# Altium schematic sheet Sheet1.SchDoc
size A3; SheetNumber: 1; SheetTotal: 1
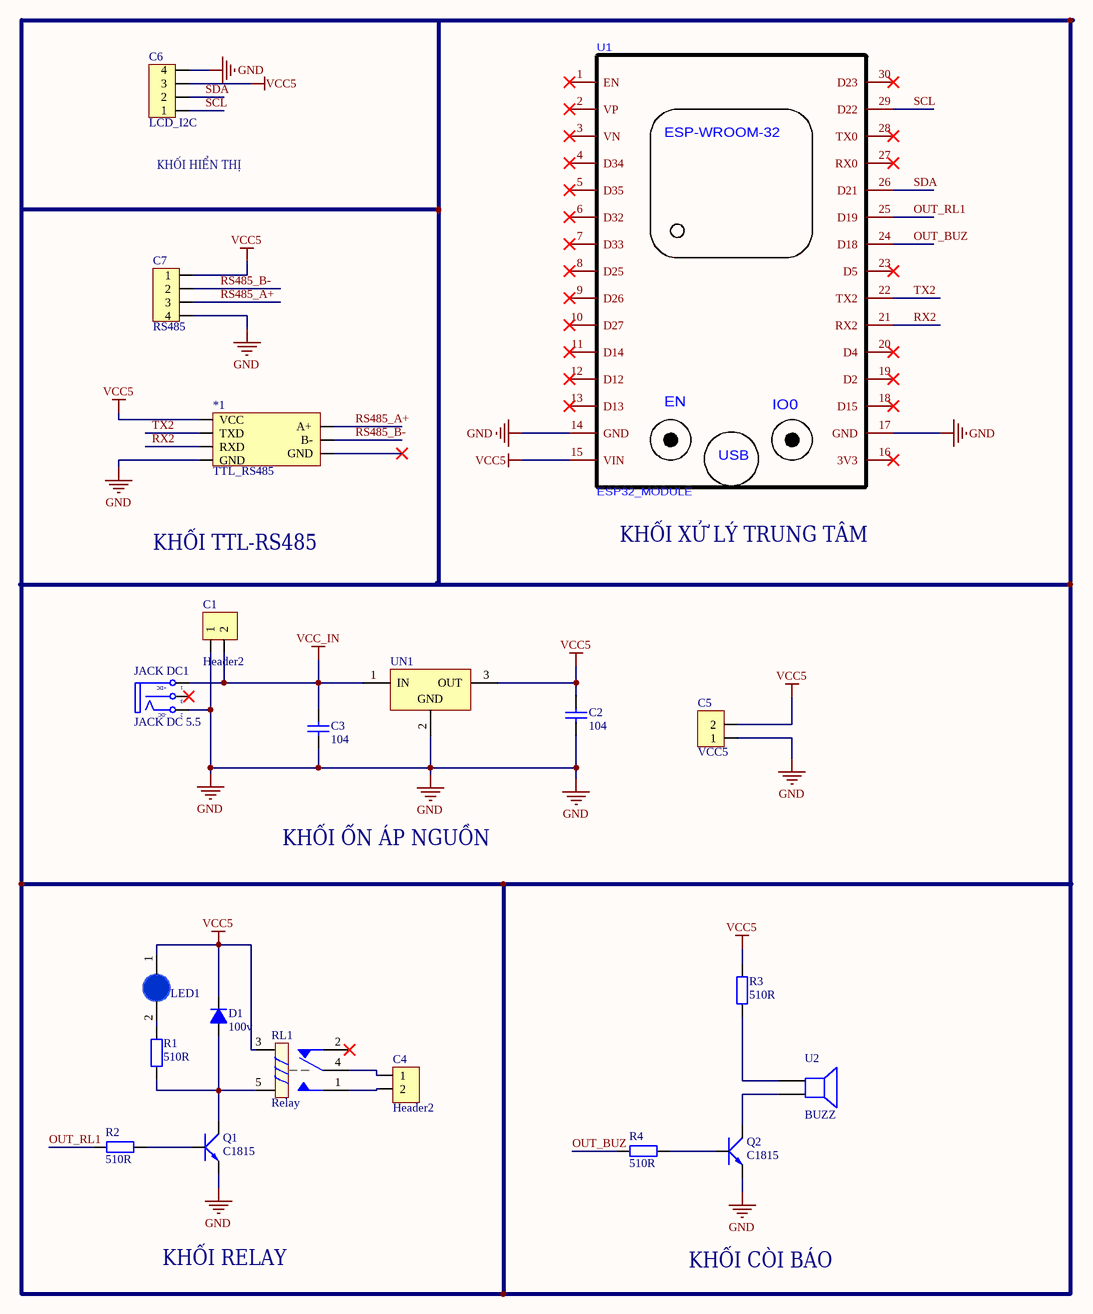
[diagram p0: Sheet1.SchDoc]

## Parts
*1  TTL_RS485  [RS-485 Module]
C1  Header2  [Header2]
C2  104  [tu gom]
C3  104  [tu gom]
C4  Header2  [Header2]
C5  VCC5  [Header2]
C6  LCD_I2C  [Header4]
C7  RS485  [Header4]
D1  100v  [DIODE 0.5A]
JACK_DC1  JACK DC 5.5  [JACK DC 5.5]
LED1  LED 3mm  [LED-3MM-BLUE]  (value not drawn)
Q1  C1815  [C1815_cam]
Q2  C1815  [C1815_cam]
R1  510R  [R1/4W]
R2  510R  [R1/4W]
R3  510R  [R1/4W]
R4  510R  [R1/4W]
RL1  Relay  [RELAY_SRA_05VDC_SL_C]
U1  ESP32_MODULE  [ESP32-WIFIMODULE-FOOTPRINT]
U2  BUZZ  [BUZZER_D9_TH]
UN1  L78M05CP  [QTO-220H2]  (value not drawn)

## Nets
GND: *1.4(GND) C1.1 C2.2 C3.2 C5.1 C6.4 C7.4 JACK_DC1.2(TN) Q1.1(E) Q2.1(E) U1.14(GND) U1.17(GND) UN1.2(GND)
VCC5: *1.1(VCC) C2.1 C5.2 C6.3 C7.1 D1.2(K) LED1.1(A) R3.1 RL1.3 U1.15(VIN) UN1.3(OUT)
VCC_IN: C1.2 C3.1 JACK_DC1.1(T) UN1.1(IN)
OUT_BUZ: R4.1 U1.24(D18)
OUT_RL1: R2.1 U1.25(D19)
RS485_A+: *1.7(A+) C7.3
RS485_B-: *1.6(B-) C7.2
RX2: *1.3(RXD) U1.21(RX2)
SCL: C6.1 U1.29(D22)
SDA: C6.2 U1.26(D21)
TX2: *1.2(TXD) U1.22(TX2)
NetC4_1: C4.1 RL1.4
NetC4_2: C4.2 RL1.1
NetD1_1: D1.1(A) Q1.2(C) R1.2 RL1.5
NetLED1_2: LED1.2(K) R1.1
NetQ1_3: Q1.3(B) R2.2
NetQ2_2: Q2.2(C) U2.2
NetQ2_3: Q2.3(B) R4.2
NetR3_2: R3.2 U2.1

Not connected (* = marked no-connect by the designer): *1 5(GND)*; JACK_DC1 3(S)*; RL1 2*; U1 1(EN)* 2(VP)* 3(VN)* 4(D34)* 5(D35)* 6(D32)* 7(D33)* 8(D25)* 9(D26)* 10(D27)* 11(D14)* 12(D12)* 13(D13)* 16(3V3)* 18(D15)* 19(D2)* 20(D4)* 23(D5)* 27(RX0)* 28(TX0)* 30(D23)*

## Notes on the sheet
- (near C6) KHỐI HIỂN THỊ
- KHỐI TTL-RS485
- KHỐI XỬ LÝ TRUNG TÂM
- KHỐI ỔN ÁP NGUỒN
- KHỐI RELAY
- KHỐI CÒI BÁO
- (in symbol ESP32_MODULE copy) ESP-WROOM-32; IO0; USB
- (in symbol JACK DC 5.5) +DC; -DC

## Library data of the parts
C1 C4 C5 = Header2: Header IDC, 2 x 1 Pin Vertical 2.54mm Pitch (Non-Boxed, Male); Manufacturer: W¨¹rth Elektronik eiSos GmbH; partNo: 613002143121; ComponentLink1 Description: Manufacturer; ComponentLink2 Description: Datasheet; NoPins: 02; Created Date: 29 March 2013; ComponentLink1URL: http://www.we-online.com; ComponentLink2URL: http://katalog.we-online.de/em/datasheet/6130xx143121.pdf; Created by: Karrer Zheng
C2 C3 = Tu gom 104 50V: Cắm; So_Chan: 2; Ten_Linh_Kien: Tụ gốm 104 100nF 50V; Don_Vi: Con; Ma_Hang: MH004761; Chung_Loai: Cắm; Kieu_Chan: *
C6 C7 = Header4: Header IDC, 4 x 1 Pin Vertical 2.54mm Pitch (Non-Boxed, Male); Manufacturer: W¨¹rth Elektronik eiSos GmbH; partNo: 613002143121; ComponentLink1 Description: Manufacturer; ComponentLink2 Description: Datasheet; NoPins: 02; Created Date: 29 March 2013; ComponentLink1URL: http://www.we-online.com; ComponentLink2URL: http://katalog.we-online.de/em/datasheet/6130xx143121.pdf; Created by: Karrer Zheng
D1 = Diode 1N4148: Cắm; Ten_Linh_Kien: Diode 1N4148 DO35 450mA 100V ( 1N4148 DIP); Don_Vi: Con; Ma_Hang: MH001065; Ghi Chu: *; Kieu_Chan: *; Chung_Loai: Cắm
JACK_DC1 = JACK DC 5.5: Value: Jac DC
LED1 = LED 3mm Xanh Duong: Cắm; Don_Vi: Con; Ma_Hang: MH009003; Ten_Linh_Kien: LED 3MM Xanh Dương SS (1000c); Ghi_Chu: *; Kieu_Chan: *; Chung_Loai: Cắm
Q1 Q2 = C1815: NPN 600mW, ECB; Value: C1815
R1-R4 = R1/4W: Resistor 1/4W; Value: R1/4W - 1K
RL1 = RL_SRA-05VDC-SL-C: Relay 5 Chan; Ma_Hang: MH009374; Ten: Relay 5V10A SRD-05VDC-SL-C Chính Hãng
U1 = ESP32_MODULE copy
U2 = Speaker: Loudspeaker
UN1 = L78M05CP: Positive Voltage Regulator; Note: Tab is connected to pin 3 (GND).; Published: 24-Aug-2001; LatestRevisionDate: 17-Jul-2002; LatestRevisionNote: Re-released for DXP Platform.; DatasheetVersion: Apr-1994; PackageVersion: Jul-1998; PackageReference: ISOWATT220AB; Publisher: Altium Limited; PackageDescription: TO, Thru-Hole, Vertical, Heatsink Mounted; 3 In-Line Leads; Pitch 2.54 mm; Pin sequence 1, 3, 2; ComponentLink1Description: Manufacturer Link; ComponentLink1URL: http://www.st.com/; ComponentLink2Description: Datasheet; ComponentLink2URL: http://www.st.com/stonline/products/literature/ds/2146/l78m05c.pdf